# Altium schematic sheet esquema.SchDoc
size A3
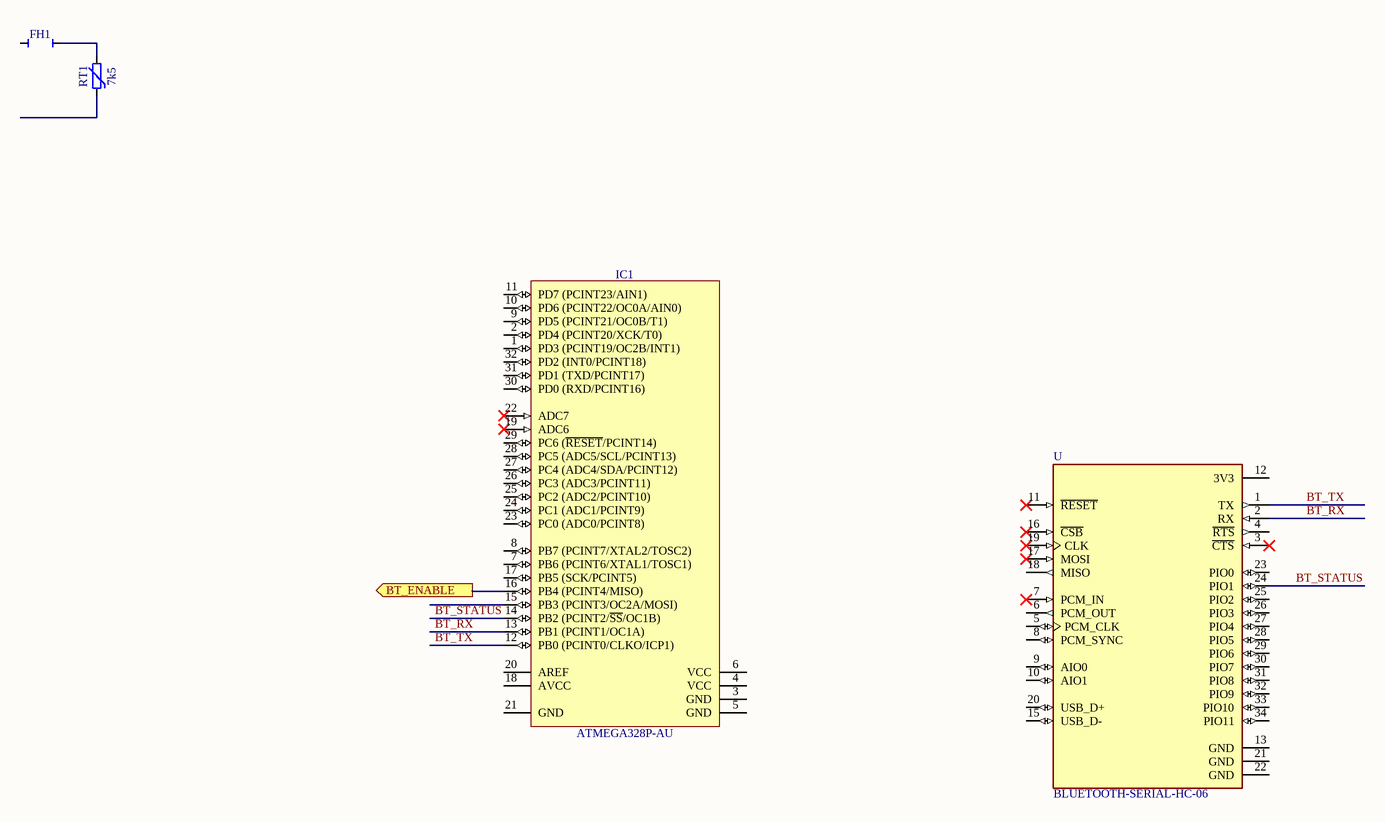
[diagram p0: esquema.SchDoc]

## Parts
FH1  Fuse Holder  [FUSH_SCHURTER_0031.7601]  (value not drawn)
IC1  ATMEGA328P-AU  [QFP80P900X900X120-32N]
RT1  7k5  [THERM_EPCOS_B75x]
U  BLUETOOTH-SERIAL-HC-06  [XCVR_BLUETOOTH-SERIAL-HC-06]

## Ports
BT_ENABLE (out)

## Nets
BT_ENABLE: IC1.16(PB4_(PCINT4/MISO)) ; port BT_ENABLE
BT_RX: IC1.13(PB1_(PCINT1/OC1A)) U.2(RX)
BT_STATUS: IC1.14(PB2_(PCINT2/~{SS}/OC1B)) U.24(PIO1)
BT_TX: IC1.12(PB0_(PCINT0/CLKO/ICP1)) U.1(TX)
NetFH1_2: FH1.2 RT1.2

Not connected (* = marked no-connect by the designer): FH1 1; IC1 1(PD3_(PCINT19/OC2B/INT1)) 2(PD4_(PCINT20/XCK/T0)) 3(GND) 4(VCC) 5(GND) 6(VCC) 7(PB6_(PCINT6/XTAL1/TOSC1)) 8(PB7_(PCINT7/XTAL2/TOSC2)) 9(PD5_(PCINT21/OC0B/T1)) 10(PD6_(PCINT22/OC0A/AIN0)) 11(PD7_(PCINT23/AIN1)) 15(PB3_(PCINT3/OC2A/MOSI)) 17(PB5_(SCK/PCINT5)) 18(AVCC) 19(ADC6)* 20(AREF) 21(GND) 22(ADC7)* 23(PC0_(ADC0/PCINT8)) 24(PC1_(ADC1/PCINT9)) 25(PC2_(ADC2/PCINT10)) 26(PC3_(ADC3/PCINT11)) 27(PC4_(ADC4/SDA/PCINT12)) 28(PC5_(ADC5/SCL/PCINT13)) 29(PC6_(~{RESET}/PCINT14)) 30(PD0_(RXD/PCINT16)) 31(PD1_(TXD/PCINT17)) 32(PD2_(INT0/PCINT18)); RT1 1; U 3(~{CTS})* 4(~{RTS}) 5(PCM_CLK) 6(PCM_OUT) 7(PCM_IN)* 8(PCM_SYNC) 9(AIO0) 10(AIO1) 11(~{RESET})* 12(3V3) 13(GND) 15(USB_D-) 16(~{CSB})* 17(MOSI)* 18(MISO) 19(CLK)* 20(USB_D+) 21(GND) 22(GND) 23(PIO0) 25(PIO2) 26(PIO3) 27(PIO4) 28(PIO5) 29(PIO6) 30(PIO7) 31(PIO8) 32(PIO9) 33(PIO10) 34(PIO11)

## Notes on the sheet
- Title
- Size:
- Date:
- A3
- Number:
- Time:
- Revision:
- Sheet
- of
- File:

## Library data of the parts
FH1 = FUSH_SCHURTER_0031.7601: Part Description: Vertical Fuse Holder For D8.5 x H8.5mm Subminiature Fuses; PressFit: No; Part Number: FUSH_SCHURTER_0031.7601; Component Kind: Standard; Component Type: Standard; Pin Count: 2; PackageDescription: Vertical Fuse Holder For D8.5x H 8.5mm Subminiature Fuses; Family: Fuse Holder; Mounted: Yes; Socket: No; SMD: No; Sense: No; Manufacturer: SCHURTER; Manufacturer Part Number: 0031.7601; ComponentHeight: 4.4mm; HelpURL: \\cern.ch\dfs\Applications\Altium\Datasheets\FUSH_SCHURTER_0031.7601.pdf; Author: CERN DEM JLC; CreateDate: 12/09/2012; LatestRevisionDate: 12/09/2012
IC1 = ATMEGA328P-AU: 8-bit AVR Microcontroller, 32KB Flash, 1KB EEPROM, 2KB SRAM, 32-pin TQFP, Industrial Grade (-40°C to 85°C); Manufacturer: ATMEL; PressFit: No; Bonding: No; Part Number: ATMEGA328P-AU; Component Kind: Standard; Component Type: Standard; Device: ATMEGA328P-AU; PackageDescription: QFP,0.80mm Pitch, Square; 32 Pin, 7.00mm L X 7.00mm W X 1.20mm H Body, IPC Medium Density; Part Description: 8-bit AVR Microcontroller, 32KB Flash, 1KB EEPROM, 2KB SRAM, 32-pin TQFP, Industrial Grade (-40°C to 85°C); Manufacturer Part Number: ATMEGA328P-AU; Pin Count: 32; Case: QFP32; Mounted: Yes; Socket: No; SMD: Yes; Sense: No; ComponentHeight: 1.2mm; HelpURL: \\cern.ch\dfs\Applications\Altium\Datasheets\ATMEGA328P-AU.pdf; Author: CERN DEM JLC; CreateDate: 02/07/2014; LatestRevisionDate: 02/07/2014
RT1 = THERM_PTC_7K5_EPCOS_B59758B0110A070: Thermistor NTC (Positive Temperature Coefficient); Part Description: PTC Thermistors for Overcurrent Protection; Manufacturer: EPCOS; Power: 8mA; Voltage: 1000VDC; Tolerance: ±33%; Part Number: THERM_PTC_7K5_EPCOS_B59758B0110A070; Component Kind: Standard; Component Type: Standard; Pin Count: 2; Value: 7k5; Status: None; Manufacturer Part Number: B59758B0110A070; Mounted: Yes; Socket: No; SMD: No; Sense: No; ComponentHeight: 16.5mm; HelpURL: \\cern.ch\dfs\Applications\Altium\Datasheets\THERM_EPCOS_B5975xx.pdf; Author: CERN DEM BC; CreateDate: 13/11/2015; LatestRevisionDate: 13/11/2015
U = BLUETOOTH-SERIAL-HC-06: Bluetooth Modules _802.15.1_ BLUETOOTH-SERIAL-HC-06; MF: Olimex; Price: None; Package: None; Value: *; MP: BLUETOOTH-SERIAL-HC-06; Availability: Unavailable; SnapEDA_Link: https://www.snapeda.com/parts/BLUETOOTH-SERIAL-HC-06/Olimex/view-part/2768234/?ref=snap